# EAGLE design ESP32_BioReactor_v1 (EAGLE 9.6.1)
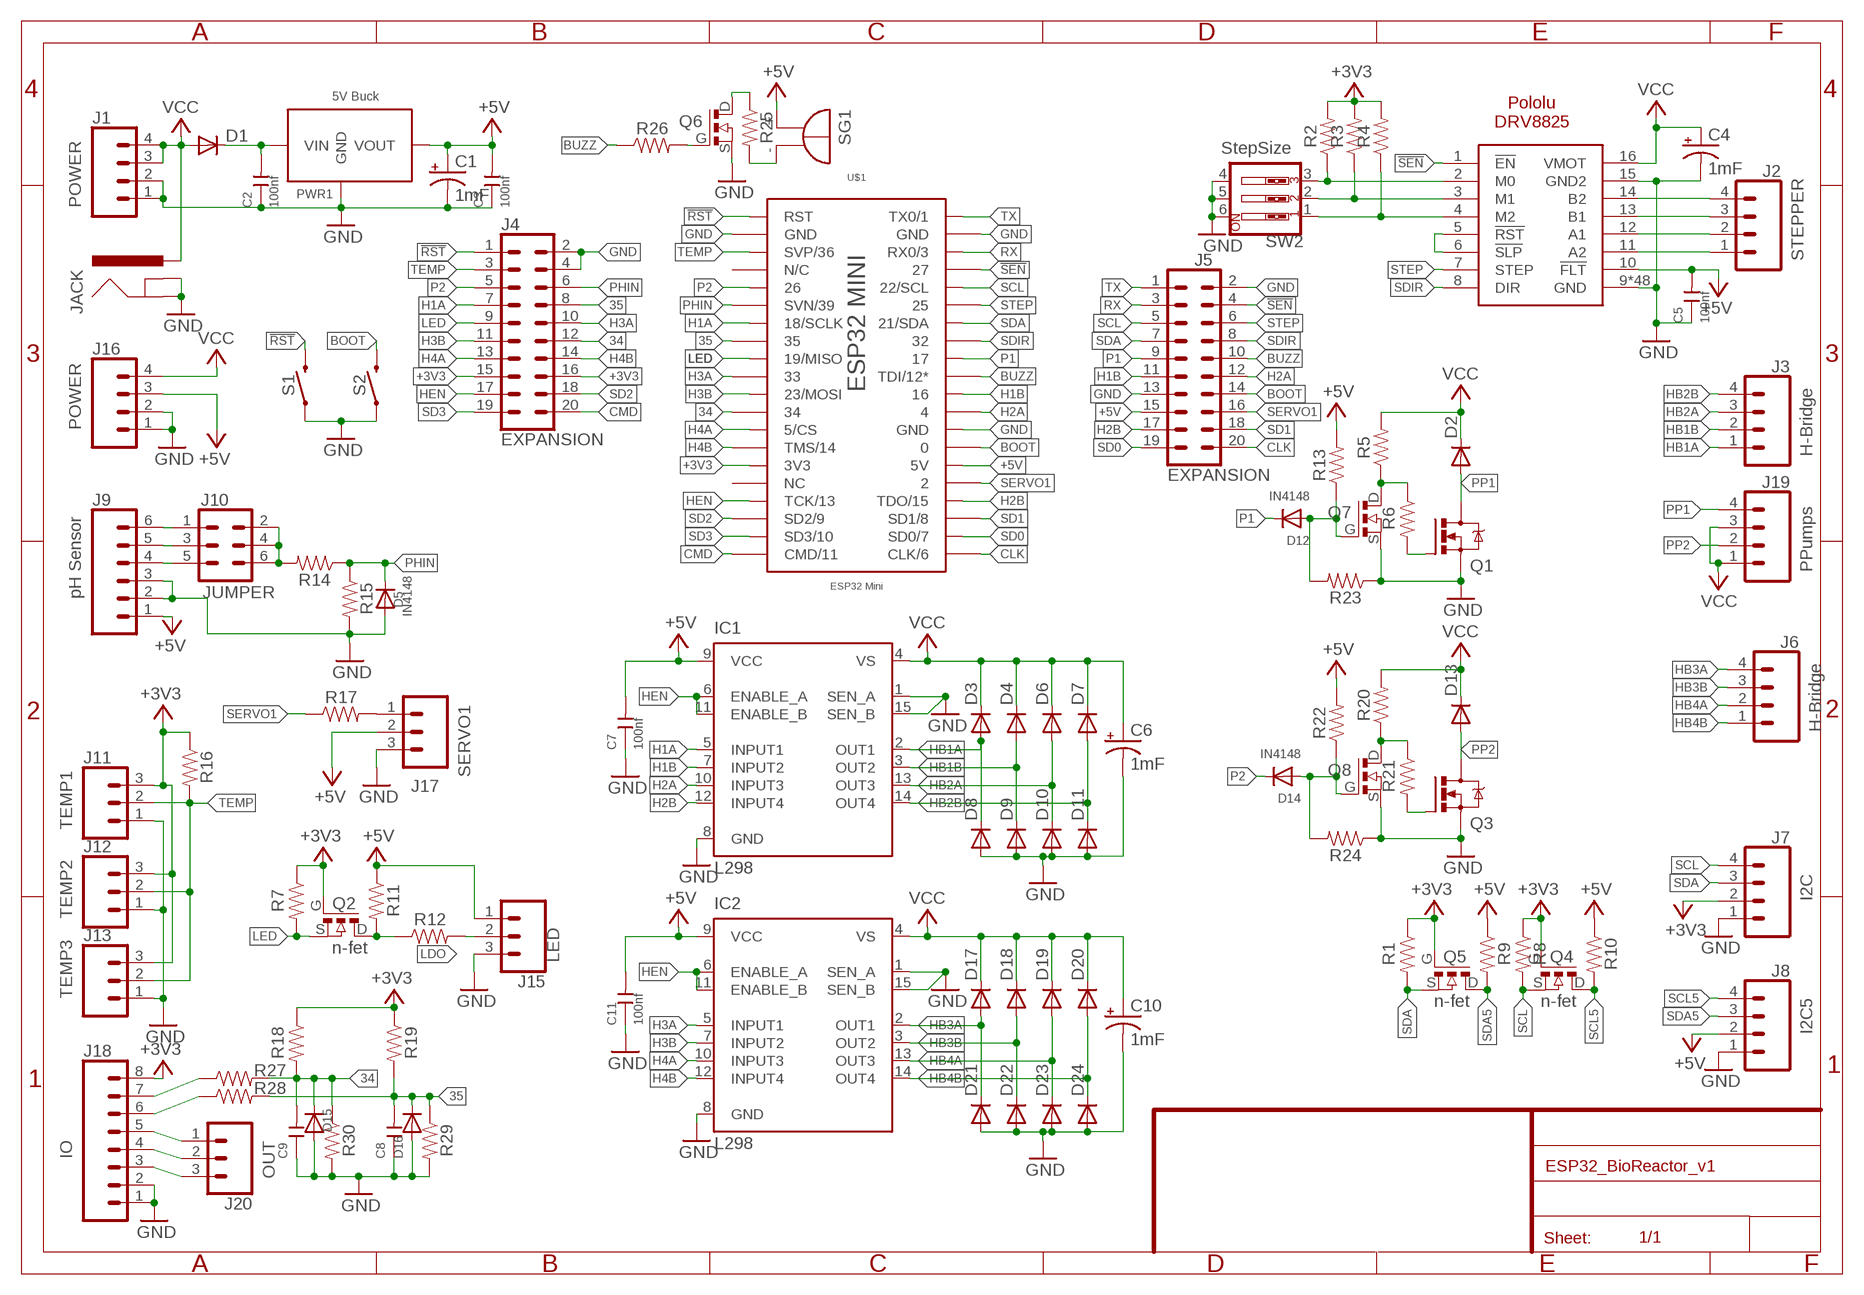
[diagram p0: schematic, sheet 1]

## Parts
C1  1mF  1000UF-RADIAL-5MM-25V-20%  [CPOL-RADIAL-5MM-10MM]
C2  100nf  DIP-CERAMIC-DISC-100NF-50V-Y5V(D5.0MM)  [CERAMIC-2.54]
C3  100nf  DIP-CERAMIC-DISC-100NF-50V-Y5V(D5.0MM)  [CERAMIC-2.54]
C4  1mF  1000UF-RADIAL-5MM-25V-20%  [CPOL-RADIAL-5MM-10MM]
C5  100nf  DIP-CERAMIC-DISC-100NF-50V-Y5V(D5.0MM)  [CERAMIC-2.54]
C6  1mF  1000UF-RADIAL-5MM-25V-20%  [CPOL-RADIAL-5MM-10MM]
C7  100nf  DIP-CERAMIC-DISC-100NF-50V-Y5V(D5.0MM)  [CERAMIC-2.54]
C8  100nf  DIP-CERAMIC-DISC-100NF-50V-Y5V(D5.0MM)  [CERAMIC-2.54]
C9  100nf  DIP-CERAMIC-DISC-100NF-50V-Y5V(D5.0MM)  [CERAMIC-2.54]
C10  1mF  1000UF-RADIAL-5MM-25V-20%  [CPOL-RADIAL-5MM-10MM]
C11  100nf  DIP-CERAMIC-DISC-100NF-50V-Y5V(D5.0MM)  [CERAMIC-2.54]
D1  1N4004  [DO41-10]
D2  1N4004  [DO41-10]
D3  1N4004  [DO41-10]
D4  1N4004  [DO41-10]
D5  IN4148  DIODEDO-1N4148  [DO-1N4148]
D6  1N4004  [DO41-10]
D7  1N4004  [DO41-10]
D8  1N4004  [DO41-10]
D9  1N4004  [DO41-10]
D10  1N4004  [DO41-10]
D11  1N4004  [DO41-10]
D12  IN4148  DIODEDO-1N4148  [DO-1N4148]
D13  1N4004  [DO41-10]
D14  IN4148  DIODEDO-1N4148  [DO-1N4148]
D15  IN4148  DIODEDO-1N4148  [DO-1N4148]
D16  IN4148  DIODEDO-1N4148  [DO-1N4148]
D17  1N4004  [DO41-10]
D18  1N4004  [DO41-10]
D19  1N4004  [DO41-10]
D20  1N4004  [DO41-10]
D21  1N4004  [DO41-10]
D22  1N4004  [DO41-10]
D23  1N4004  [DO41-10]
D24  1N4004  [DO41-10]
DR1  DRV8825  POLOLU-DRV8825  [POLOLU-DRV8825]
IC1  L298  [MULTIWATT-15]
IC2  L298  [MULTIWATT-15]
J1  POWER  CONN_04LONGPADS  [1X04_LONGPADS]
J2  STEPPER  CONN_04LONGPADS  [1X04_LONGPADS]
J3  H-Bridge  CONN_04LONGPADS  [1X04_LONGPADS]
J4  EXPANSION  CONN_10X2NOSILK  [2X10_NOSILK]
J5  EXPANSION  CONN_10X2NOSILK  [2X10_NOSILK]
J6  H-Bridge  CONN_04LONGPADS  [1X04_LONGPADS]
J7  I2C  CONN_04LONGPADS  [1X04_LONGPADS]
J8  I2C5  CONN_04LONGPADS  [1X04_LONGPADS]
J9  pH Sensor  CONN_06LONGPADS  [1X06_LONGPADS]
J10  JUMPER  CONN_03X2FEMALE  [2X3]
J11  TEMP1  CONN_03LONGPADS  [1X03_LONGPADS]
J12  TEMP2  CONN_03LONGPADS  [1X03_LONGPADS]
J13  TEMP3  CONN_03LONGPADS  [1X03_LONGPADS]
J15  LED  CONN_03LONGPADS  [1X03_LONGPADS]
J16  POWER  CONN_04LONGPADS  [1X04_LONGPADS]
J17  SERVO1  CONN_03LONGPADS  [1X03_LONGPADS]
J18  IO  CONN_08LONGPADS  [1X08_LONGPADS]
J19  PPumps  CONN_04LONGPADS  [1X04_LONGPADS]
J20  OUT  CONN_03  [1X03]
JACK  POWER_JACKPTH_LOCK  [POWER_JACK_PTH_LOCK]
PWR1  5V Buck  5VBUCK  [5VBUCK]
Q1  IRF740  [TO220BV]
Q2  n-fet  2N7000  [TO92260P520H533-3]
Q3  IRF740  [TO220BV]
Q4  n-fet  2N7000  [TO92260P520H533-3]
Q5  n-fet  2N7000  [TO92260P520H533-3]
Q6  2N7000  [TO92260P520H533-3]
Q7  2N7000  [TO92260P520H533-3]
Q8  2N7000  [TO92260P520H533-3]
R1  10k  10KOHM-HORIZ-1/4W-1%  [AXIAL-0.3]
R2  10k  10KOHM-HORIZ-1/4W-1%  [AXIAL-0.3]
R3  10k  10KOHM-HORIZ-1/4W-1%  [AXIAL-0.3]
R4  10k  10KOHM-HORIZ-1/4W-1%  [AXIAL-0.3]
R5  10k  10KOHM-HORIZ-1/4W-1%  [AXIAL-0.3]
R6  10k  10KOHM-HORIZ-1/4W-1%  [AXIAL-0.3]
R7  10k  10KOHM-HORIZ-1/4W-1%  [AXIAL-0.3]
R8  10k  10KOHM-HORIZ-1/4W-1%  [AXIAL-0.3]
R9  10k  10KOHM-HORIZ-1/4W-1%  [AXIAL-0.3]
R10  10k  10KOHM-HORIZ-1/4W-1%  [AXIAL-0.3]
R11  10k  10KOHM-HORIZ-1/4W-1%  [AXIAL-0.3]
R12  10k  10KOHM-HORIZ-1/4W-1%  [AXIAL-0.3]
R13  10k  10KOHM-HORIZ-1/4W-1%  [AXIAL-0.3]
R14  10k  10KOHM-HORIZ-1/4W-1%  [AXIAL-0.3]
R15  10k  10KOHM-HORIZ-1/4W-1%  [AXIAL-0.3]
R16  10k  10KOHM-HORIZ-1/4W-1%  [AXIAL-0.3]
R17  10k  10KOHM-HORIZ-1/4W-1%  [AXIAL-0.3]
R18  10k  10KOHM-HORIZ-1/4W-1%  [AXIAL-0.3]
R19  10k  10KOHM-HORIZ-1/4W-1%  [AXIAL-0.3]
R20  10k  10KOHM-HORIZ-1/4W-1%  [AXIAL-0.3]
R21  10k  10KOHM-HORIZ-1/4W-1%  [AXIAL-0.3]
R22  10k  10KOHM-HORIZ-1/4W-1%  [AXIAL-0.3]
R23  10k  10KOHM-HORIZ-1/4W-1%  [AXIAL-0.3]
R24  10k  10KOHM-HORIZ-1/4W-1%  [AXIAL-0.3]
R25  10k  10KOHM-HORIZ-1/4W-1%  [AXIAL-0.3]
R26  10k  10KOHM-HORIZ-1/4W-1%  [AXIAL-0.3]
R27  10k  10KOHM-HORIZ-1/4W-1%  [AXIAL-0.3]
R28  10k  10KOHM-HORIZ-1/4W-1%  [AXIAL-0.3]
R29  10k  10KOHM-HORIZ-1/4W-1%  [AXIAL-0.3]
R30  10k  10KOHM-HORIZ-1/4W-1%  [AXIAL-0.3]
S1  MOMENTARY-SWITCH-SPST-PTH-6.0MM  [TACTILE_SWITCH_PTH_6.0MM]
S2  MOMENTARY-SWITCH-SPST-PTH-6.0MM  [TACTILE_SWITCH_PTH_6.0MM]
SG1  F/HMB  [F/HMB]
SW2  StepSize  SW_DIP-3  [EDG-03]
U$1  ESP32 Mini  ESP32MINI  [ESP32MINI]

## Nets
34: C9.2 D15.C J4.12 R18.P$2 R27.P$2 R30.P$1 U$1.34
35: C8.2 D16.C J4.8 R19.P$2 R28.P$2 R29.P$1 U$1.35
!RST: J4.1 S1.3 U$1.RST
!SEN: DR1.1(!EN) J5.4 U$1.27
+3V3: J4.15 J4.16 J7.2 J11.3 J12.3 J13.3 J18.8 Q2.G Q4.G Q5.G R1.P$1 R2.P$2 R3.P$2 R4.P$2 R7.P$1 R8.P$1 R16.P$1 R18.P$1 R19.P$1 U$1.3V3
+5V [5V]: C1.+ C3.2 C5.2 C7.2 C11.2 DR1.10(!FLT) IC1.9(VCC) IC2.9(VCC) J5.15 J8.2 J9.1 J15.1 J16.3 J17.2 PWR1.VOUT R9.P$1 R10.P$1 R11.P$1 R13.P$2 R22.P$2 SG1.+ U$1.5V
BOOT: J5.14 S2.3 U$1.0
BUZZ: J5.10 R26.P$1 U$1.TDI(TDI/12*)
CLK: J5.20 U$1.CLK(CLK/6)
CMD: J4.20 U$1.CMD(CMD/11)
GND [GND]: C1.- C2.1 C3.1 C4.- C5.1 C6.- C7.1 C8.1 C9.1 C10.- C11.1 D5.A D8.A D9.A D10.A D11.A D15.A D16.A D21.A D22.A D23.A D24.A DR1.9(GND) DR1.15(GND2) DR1.GND@1(GND) DR1.GND@2(GND) DR1.GND@3(GND) DR1.GND@4(GND) DR1.GND@5(GND) DR1.GND@6(GND) DR1.GND@7(GND) DR1.GND@8(GND) DR1.GND@9(GND) DR1.GND@10(GND) DR1.GND@11(GND) DR1.GND@12(GND) DR1.GND@13(GND) DR1.GND@14(GND) DR1.GND@15(GND) DR1.GND@16(GND) DR1.GND@17(GND) DR1.GND@18(GND) DR1.GND@19(GND) DR1.GND@20(GND) DR1.GND@21(GND) DR1.GND@22(GND) DR1.GND@23(GND) DR1.GND@24(GND) DR1.GND@25(GND) DR1.GND@26(GND) DR1.GND@27(GND) DR1.GND@28(GND) DR1.GND@29(GND) DR1.GND@30(GND) DR1.GND@31(GND) DR1.GND@32(GND) DR1.GND@33(GND) DR1.GND@34(GND) DR1.GND@35(GND) DR1.GND@36(GND) DR1.GND@37(GND) DR1.GND@38(GND) DR1.GND@39(GND) DR1.GND@40(GND) DR1.GND@41(GND) DR1.GND@42(GND) DR1.GND@43(GND) DR1.GND@44(GND) DR1.GND@45(GND) DR1.GND@50(GND) DR1.GND@51(GND) IC1.1(SEN_A) IC1.8(GND) IC1.15(SEN_B) IC2.1(SEN_A) IC2.8(GND) IC2.15(SEN_B) J1.1 J1.2 J4.2 J4.4 J5.2 J5.13 J7.1 J8.1 J9.2 J9.3 J11.1 J12.1 J13.1 J15.3 J16.1 J16.2 J17.3 J18.1 J18.2 JACK.GND JACK.GNDBREAK PWR1.GND Q1.S Q3.S Q6.S Q7.S Q8.S R15.P$2 R23.P$1 R24.P$1 R29.P$2 R30.P$2 S1.1 S2.1 SW2.4 SW2.5 SW2.6 U$1.GND@1(GND) U$1.GND@2(GND) U$1.GND@3(GND)
H1A: IC1.5(INPUT1) J4.7 U$1.18(18/SCLK)
H1B: IC1.7(INPUT2) J5.11 U$1.16
H2A: IC1.10(INPUT3) J5.12 U$1.4
H2B: IC1.12(INPUT4) J5.17 U$1.TDO(TDO/15)
H3A: IC2.5(INPUT1) J4.10 U$1.33
H3B: IC2.7(INPUT2) J4.11 U$1.23(23/MOSI)
H4A: IC2.10(INPUT3) J4.13 U$1.5(5/CS)
H4B: IC2.12(INPUT4) J4.14 U$1.TMS(TMS/14)
HB1A [POWER]: D3.A D8.C IC1.2(OUT1) J3.1
HB1B [POWER]: D4.A D9.C IC1.3(OUT2) J3.2
HB2A [POWER]: D6.A D10.C IC1.13(OUT3) J3.3
HB2B [POWER]: D7.A D11.C IC1.14(OUT4) J3.4
HB3A [POWER]: D17.A D21.C IC2.2(OUT1) J6.4
HB3B [POWER]: D18.A D22.C IC2.3(OUT2) J6.3
HB4A [POWER]: D19.A D23.C IC2.13(OUT3) J6.2
HB4B [POWER]: D20.A D24.C IC2.14(OUT4) J6.1
HEN: IC1.6(ENABLE_A) IC1.11(ENABLE_B) IC2.6(ENABLE_A) IC2.11(ENABLE_B) J4.17 U$1.TCK(TCK/13)
LDO: J15.2 R12.P$2
LED: J4.9 Q2.S R7.P$2 U$1.19(19/MISO)
N$1: DR1.3(M1) R3.P$1 SW2.2
N$2 [5V]: C2.2 D1.C PWR1.VIN
N$3: DR1.4(M2) R4.P$1 SW2.1
N$4: Q7.D R5.P$1 R6.P$1
N$5: DR1.5(!RST) DR1.6(!SLP)
N$6: J10.2 J10.4 J10.6 R14.P$2
N$7: Q1.G R6.P$2
N$8: DR1.2(M0) R2.P$1 SW2.3
N$9: Q8.D R20.P$1 R21.P$1
N$10: R25.P$2 SG1.-
N$11: Q3.G R21.P$2
N$12 [POWER]: DR1.11(A2) J2.1
N$13 [POWER]: DR1.12(A1) J2.2
N$14 [POWER]: DR1.13(B1) J2.3
N$15 [POWER]: DR1.14(B2) J2.4
N$16: D14.A Q8.G R22.P$1 R24.P$2
N$17: J9.4 J10.5
N$18: Q6.D R25.P$1
N$19: Q6.G R26.P$2
N$20: J9.5 J10.3
N$21: J9.6 J10.1
N$22: D12.A Q7.G R13.P$1 R23.P$2
N$23: Q2.D R11.P$2 R12.P$1
N$24: J17.1 R17.P$2
N$25: J18.5 J20.1
N$26: J18.4 J20.2
N$27: J18.3 J20.3
N$29: J18.6 R28.P$1
N$30: J18.7 R27.P$1
P1: D12.C J5.9 U$1.17
P2: D14.C J4.5 U$1.26
PHIN: D5.C J4.6 R14.P$1 R15.P$1 U$1.SVN(SVN/39)
PP1 [POWER]: D2.A J19.4 Q1.D
PP2: D13.A J19.2 Q3.D
RX: J5.3 U$1.RX0(RX0/3)
SCL: J5.5 J7.4 Q4.S R8.P$2 U$1.22(22/SCL)
SCL5: J8.4 Q4.D R10.P$2
SD0: J5.19 U$1.SD0(SD0/7)
SD1: J5.18 U$1.SD1(SD1/8)
SD2: J4.18 U$1.SD2(SD2/9)
SD3: J4.19 U$1.SD3(SD3/10)
SDA: J5.7 J7.3 Q5.S R1.P$2 U$1.21(21/SDA)
SDA5: J8.3 Q5.D R9.P$2
SDIR: DR1.8(DIR) J5.8 U$1.32
SERVO1: J5.16 R17.P$1 U$1.2
STEP: DR1.7(STEP) J5.6 U$1.25
TEMP: J4.3 J11.2 J12.2 J13.2 R16.P$2 U$1.SVP(SVP/36)
TX: J5.1 U$1.TX0(TX0/1)
VCC [POWER]: C4.+ C6.+ C10.+ D1.A D2.C D3.C D4.C D6.C D7.C D13.C D17.C D18.C D19.C D20.C DR1.16(VMOT) IC1.4(VS) IC2.4(VS) J1.3 J1.4 J16.4 J19.1 J19.3 JACK.PWR R5.P$2 R20.P$2
Unconnected: U$1.NC(N/C) U$1.NC.1(NC)

## Library data of the parts
C1 C4 C6 C10 = 1_Adrian:1000UF: 1,000µF/1mF ceramic capacitors A capacitor is a passive two-terminal electrical component used to store electrical energy temporarily in an electric field. CAP-08070; PROD_ID: CAP-09538
C2 C3 C5 C7-C9 C11 = 1_Adrian:DIP-CERAMIC-DISC-100NF-50V-Y5V(D5.0MM): 302010208; MPN: CC1-F5SL2A101KSPW
D1-D4 D6-D11 D13 D17-D24 = 1_Adrian:1N4004: DIODE General purpose 1N400x type rectifier (With bigger pads) http://www.ladyada.net/library/pcb/eaglelibrary.html
D5 D12 D14-D16 = adafruit:DIODE: Diode SMADIODE - SMA Surface Mount Package 20V 1A Schottky Diode Digikey: 641-1014-6-ND DO-1N4148 - Through Hole Small Current Diode SOD-123 20V 1 A (.5mV Vf) Schottky Diode - Digikey: MBRX120TPMSCT-ND SOD-323 10V 570mA (.38mV Vf, 3ns) Schottky Diode - Digikey: ZLLS410CT-ND SOD-523 30V 30mA Schottky Diode (RB751S-40TE61) - Digikey: RB751S-40TE61CT-ND SOT23-R/W - SOT23 Package (R = Solder Paste/Reflow Ovens, W = Hand-Soldering) BAT54Film 40V 300mA - Digikey: 497-7162-1-ND
DR1 = 1_Adrian:POLOLU-DRV8825
IC1 IC2 = st-microelectronics:L298: DUAL FULL-BRIDGE DRIVER; MPN: L298N; OC_FARNELL: 1589425; OC_NEWARK: 32M1527
J1-J3 J6-J8 J16 J19 = 1_Adrian:CONN_04: Multi connection point. Often used as Generic Header-pin footprint for 0.1 inch spaced/style header connections On any of the 0.1 inch spaced packages, you can populate with these: Break Away Headers - Straight <https://www.sparkfun.com/products/116> (PRT-00116) Break Away Male Headers - Right Angle <https://www.sparkfun.com/products/553> (PRT-00553) Female Headers <https://www.sparkfun.com/products/115> (PRT-00115) Break Away Headers - Machine Pin <https://www.sparkfun.com/products/117> (PRT-00117) Break Away Female Headers - Swiss Machine Pin <https://www.sparkfun.com/products/743> (PRT-00743) For SCREWTERMINALS and SPRING TERMINALS visit here: Screw Terimnals on SparkFun.com <https://www.sparkfun.com/search/results?term=Screw+Terminals> (5mm/3.5mm/2.54mm spacing) This device is also useful as a general connection point to wire up your design to another part of your project. Our various solder wires solder well into these plated through hole pads. Hook-Up Wire - Assortment (Stranded, 22 AWG) <https://www.sparkfun.com/products/11375> (PRT-11375) Hook-Up Wire - Assortment (Solid Core, 22 AWG) <https://www.sparkfun.com/products/11367> (PRT-11367) View the entire wire category on our website here <https://www.sparkfun.com/categories/141> Special notes: Molex polarized connector foot print use with SKU : PRT-08231 with associated crimp pins and housings. 1MM SMD Version SKU: PRT-10208; PROD_ID: CONN-09696
J4 J5 = SparkFun-Connectors:CONN_10X2: Multi connection point. Often used as Generic Header-pin footprint for 0.1 inch spaced/style header connections On any of the 0.1 inch spaced packages, you can populate with these: Break Away Headers - Straight <https://www.sparkfun.com/products/116> (PRT-00116) Break Away Male Headers - Right Angle <https://www.sparkfun.com/products/553> (PRT-00553) Female Headers <https://www.sparkfun.com/products/115> (PRT-00115) Break Away Headers - Machine Pin <https://www.sparkfun.com/products/117> (PRT-00117) Break Away Female Headers - Swiss Machine Pin <https://www.sparkfun.com/products/743> (PRT-00743) Special note about the "SPECIAL" package: This was SPECIALLY designed to be used with our Graphic LCD Backpack. Be sure you want to use this! It is not only staggered on each line of header holes, but IT IS ALSO offset of the center point of the top and bottom lines by 5 mil. This causes the headers to lock into place on the "standard" footprint on the LCD screen. The extra squares on the tdocu layer are there simply to reference other pins (if you were to actually populate a longer header than ten long - this is what we do with the backpacks).
J9 = SparkFun-Connectors:CONN_06: Multi connection point. Often used as Generic Header-pin footprint for 0.1 inch spaced/style header connections On any of the 0.1 inch spaced packages, you can populate with these: Break Away Headers - Straight <https://www.sparkfun.com/products/116> (PRT-00116) Break Away Male Headers - Right Angle <https://www.sparkfun.com/products/553> (PRT-00553) Female Headers <https://www.sparkfun.com/products/115> (PRT-00115) Break Away Headers - Machine Pin <https://www.sparkfun.com/products/117> (PRT-00117) Break Away Female Headers - Swiss Machine Pin <https://www.sparkfun.com/products/743> (PRT-00743) Arduino Stackable Header - 6 Pin <https://www.sparkfun.com/products/9280> (PRT-09280) For SCREWTERMINALS and SPRING TERMINALS visit here: Screw Terimnals on SparkFun.com <https://www.sparkfun.com/search/results?term=Screw+Terminals> (5mm/3.5mm/2.54mm spacing) This device is also useful as a general connection point to wire up your design to another part of your project. Our various solder wires solder well into these plated through hole pads. Hook-Up Wire - Assortment (Stranded, 22 AWG) <https://www.sparkfun.com/products/11375> (PRT-11375) Hook-Up Wire - Assortment (Solid Core, 22 AWG) <https://www.sparkfun.com/products/11367> (PRT-11367) View the entire wire category on our website here <https://www.sparkfun.com/categories/141>
J10 = SparkFun-Connectors:CONN_03X2: Multi connection point. Often used as Generic Header-pin footprint for 0.1 inch spaced/style header connections You can populate with any combo of single row headers, but if you'd like an exact match, check these: Header - 2x3 (Male, 0.1") <https://www.sparkfun.com/products/12807> (PRT-12807) Header - 2x3 (Female, 0.1") <https://www.sparkfun.com/products/13010> (PRT-13010) 2x3 Pin Shrouded Header <https://www.sparkfun.com/products/10877> (PRT-10877) On any of the 0.1 inch spaced packages, you can populate with these: Break Away Headers - Straight <https://www.sparkfun.com/products/116> (PRT-00116) Break Away Male Headers - Right Angle <https://www.sparkfun.com/products/553> (PRT-00553) Female Headers <https://www.sparkfun.com/products/115> (PRT-00115) Break Away Headers - Machine Pin <https://www.sparkfun.com/products/117> (PRT-00117) Break Away Female Headers - Swiss Machine Pin <https://www.sparkfun.com/products/743> (PRT-00743) Special note: the shrouded connector mates well with our 3x2 ribbon cables: Ribbon Crimp Connector - 6-pin (2x3, Female) <https://www.sparkfun.com/products/10651> (PRT-10651) Ribbon Cable - 6 wire (15ft) <https://www.sparkfun.com/products/10646> (PRT-10646); PROD_ID: CONN-11566; VALUE: FEMALE 2x3
J11-J13 J15 J17 J20 = 1_Adrian:CONN_03: Multi connection point. Often used as Generic Header-pin footprint for 0.1 inch spaced/style header connections On any of the 0.1 inch spaced packages, you can populate with these: Break Away Headers - Straight <https://www.sparkfun.com/products/116> (PRT-00116) Break Away Male Headers - Right Angle <https://www.sparkfun.com/products/553> (PRT-00553) Female Headers <https://www.sparkfun.com/products/115> (PRT-00115) Break Away Headers - Machine Pin <https://www.sparkfun.com/products/117> (PRT-00117) Break Away Female Headers - Swiss Machine Pin <https://www.sparkfun.com/products/743> (PRT-00743) Stackable Header - 3 Pin (Female, 0.1") <https://www.sparkfun.com/products/13875> (PRT-13875) For SCREWTERMINALS and SPRING TERMINALS visit here: Screw Terimnals on SparkFun.com <https://www.sparkfun.com/search/results?term=Screw+Terminals> (5mm/3.5mm/2.54mm spacing) This device is also useful as a general connection point to wire up your design to another part of your project. Our various solder wires solder well into these plated through hole pads. Hook-Up Wire - Assortment (Stranded, 22 AWG) <https://www.sparkfun.com/products/11375> (PRT-11375) Hook-Up Wire - Assortment (Solid Core, 22 AWG) <https://www.sparkfun.com/products/11367> (PRT-11367) View the entire wire category on our website here <https://www.sparkfun.com/categories/141> Special notes: Molex polarized connector foot print use with SKU : PRT-08232 with associated crimp pins and housings.
J18 = SparkFun-Connectors:CONN_08: Multi connection point. Often used as Generic Header-pin footprint for 0.1 inch spaced/style header connections On any of the 0.1 inch spaced packages, you can populate with these: Break Away Headers - Straight <https://www.sparkfun.com/products/116> (PRT-00116) Break Away Male Headers - Right Angle <https://www.sparkfun.com/products/553> (PRT-00553) Female Headers <https://www.sparkfun.com/products/115> (PRT-00115) Break Away Headers - Machine Pin <https://www.sparkfun.com/products/117> (PRT-00117) Break Away Female Headers - Swiss Machine Pin <https://www.sparkfun.com/products/743> (PRT-00743) Arduino Stackable Header - 8 Pin <https://www.sparkfun.com/products/9279> (PRT-09279) For SCREWTERMINALS and SPRING TERMINALS visit here: Screw Terimnals on SparkFun.com <https://www.sparkfun.com/search/results?term=Screw+Terminals> (5mm/3.5mm/2.54mm spacing) This device is also useful as a general connection point to wire up your design to another part of your project. Our various solder wires solder well into these plated through hole pads. Hook-Up Wire - Assortment (Stranded, 22 AWG) <https://www.sparkfun.com/products/11375> (PRT-11375) Hook-Up Wire - Assortment (Solid Core, 22 AWG) <https://www.sparkfun.com/products/11367> (PRT-11367) View the entire wire category on our website here <https://www.sparkfun.com/categories/141> Special notes: Molex polarized connector foot print use with SKU : PRT-08231 with associated crimp pins and housings. 1MM SMD Version SKU: PRT-10208 NOTES ON THE VARIANTS LOCK and LOCK_LONGPADS... This footprint was designed to help hold the alignment of a through-hole component (i.e. 6-pin header) while soldering it into place. You may notice that each hole has been shifted either up or down by 0.005 of an inch from it's more standard position (which is a perfectly straight line). This slight alteration caused the pins (the squares in the middle) to touch the edges of the holes. Because they are alternating, it causes a "brace" to hold the component in place. 0.005 has proven to be the perfect amount of "off-center" position when using our standard breakaway headers. Although looks a little odd when you look at the bare footprint, once you have a header in there, the alteration is very hard to notice. Also,if you push a header all the way into place, it is covered up entirely on the bottom side.
JACK = SparkFun-Connectors:POWER_JACK: Power Jack Connector This is the standard 5.5mm barrel jack for power. The PTH is the most common, proven, reliable, footprint. The Slot footprint only works if the mill layer is transmitted to the PCB fab house so be warned. Here are the connectors we sell at SparkFun: DC Barrel Power Jack/Connector <https://www.sparkfun.com/products/119> (PRT-00119) DC Barrel Power Jack/Connector (SMD) <https://www.sparkfun.com/products/12748> (PRT-12748) DC Barrel Jack Adapter - Breadboard Compatible <https://www.sparkfun.com/products/10811> (PRT-10811) It is used on this SparkFun product (and many, many others): SparkFun RedBoard - Programmed with Arduino <https://www.sparkfun.com/products/12757> (DEV-12757) Also, if you need a mating power supply or connector, please check these out: Wall Adapter Power Supply - 9VDC 650mA <https://www.sparkfun.com/products/298> (TOL-00298) DC Barrel Jack Adapter - Male <https://www.sparkfun.com/products/10287> (PRT-10287); PROD_ID: CONN-08197; SF_ID: PRT-00119
PWR1 = 1_Adrian:5VBUCK: 5V Buck Converter (2A)
Q1 Q3 = transistor-power:IRF740: N-CHANNEL MOS FET
Q2 Q4-Q8 = 1_Adrian:2N7000; AVAILABILITY: Unavailable; DESCRIPTION: MOSFETs- Power and Small Signal 60V 200mA N-Channel No-Cancel/No-Return; MF: STMicroelectronics; MP: 2N7000; PACKAGE: TO-92 ON Semiconductor; PRICE: None
R1-R30 = 1_Adrian:10KOHM: 10kΩ resistor A resistor is a passive two-terminal electrical component that implements electrical resistance as a circuit element. Resistors act to reduce current flow, and, at the same time, act to lower voltage levels within circuits. - Wikipedia; PROD_ID: RES-12183
S1 S2 = SparkFun-Switches:MOMENTARY-SWITCH-SPST: Momentary Switch (Pushbutton) - SPST Normally-open (NO) SPST momentary switches (buttons, pushbuttons). Variants PTH-12MM - 12mm square, through-hole Momentary Pushbutton Switch - 12mm Square <https://www.sparkfun.com/products/9190> (COM-09190) PTH-6.0MM, PTH-6.0MM-KIT - 6.0mm square, through-hole Mini Pushbutton Switch <https://www.sparkfun.com/products/97> (COM-00097) KIT package intended for soldering kit's - only one side of pads' copper is exposed. PTH-RIGHT-ANGLE-KIT - Right-angle, through-hole Right Angle Tactile Button <https://www.sparkfun.com/products/10791> - Used on SparkFun BigTime Watch Kit <https://www.sparkfun.com/products/11734> SMD-12MM - 12mm square, surface-mount Tactile Button - SMD (12mm) <https://www.sparkfun.com/products/12993> (COM-12993) Used on SparkFun PicoBoard <https://www.sparkfun.com/products/11888> SMD-4.5MM - 4.5mm Square Trackball Switch Used on SparkFun Blackberry Trackballer Breakout <https://www.sparkfun.com/products/13169> SMD-4.6MMX2.8MM - 4.60mm x 2.80mm, surface mount Used on SparkFun SAMD21 Mini Breakout <https://www.sparkfun.com/products/13664> SMD-5.2MM, SMD-5.2-REDUNDANT - 5.2mm square, surface-mount Mini Pushbutton Switch - SMD <https://www.sparkfun.com/products/8720> (COM-08720) Used on Arduino Pro Mini <https://www.sparkfun.com/products/11114> REDUNDANT package connects both switch circuits together SMD-6.0X3.5MM - 6.0 x 3.5mm, surface mount Momentary Reset Switch SMD <https://www.sparkfun.com/products/8229> (COM-08229) SMD-6.2MM-TALL - 6.2mm square, surface mount Tactile Button - SMD (6mm) <https://www.sparkfun.com/products/12992> Used on SparkFun Digital Sandbox <https://www.sparkfun.com/products/12651> SMD-RIGHT-ANGLE - Right-angle, surface mount Used on SparkFun Block for Intel® Edison - Arduino <https://www.sparkfun.com/products/13036>; PROD_ID: SWCH-08441; SF_SKU: COM-00097
SG1 = buzzer:F/HMB: BUZZER Source: Buerklin; OC_FARNELL: unknown; OC_NEWARK: unknown
SW2 = 1_Adrian:SW_DIP-3: DIP SWITCH
U$1 = 1_Adrian:ESP32MINI

## Net classes
0 default: width 0.203 mm
1 5V: width 0.381 mm
3 GND: width 0.203 mm
4 POWER: width 1.016 mm

## Board
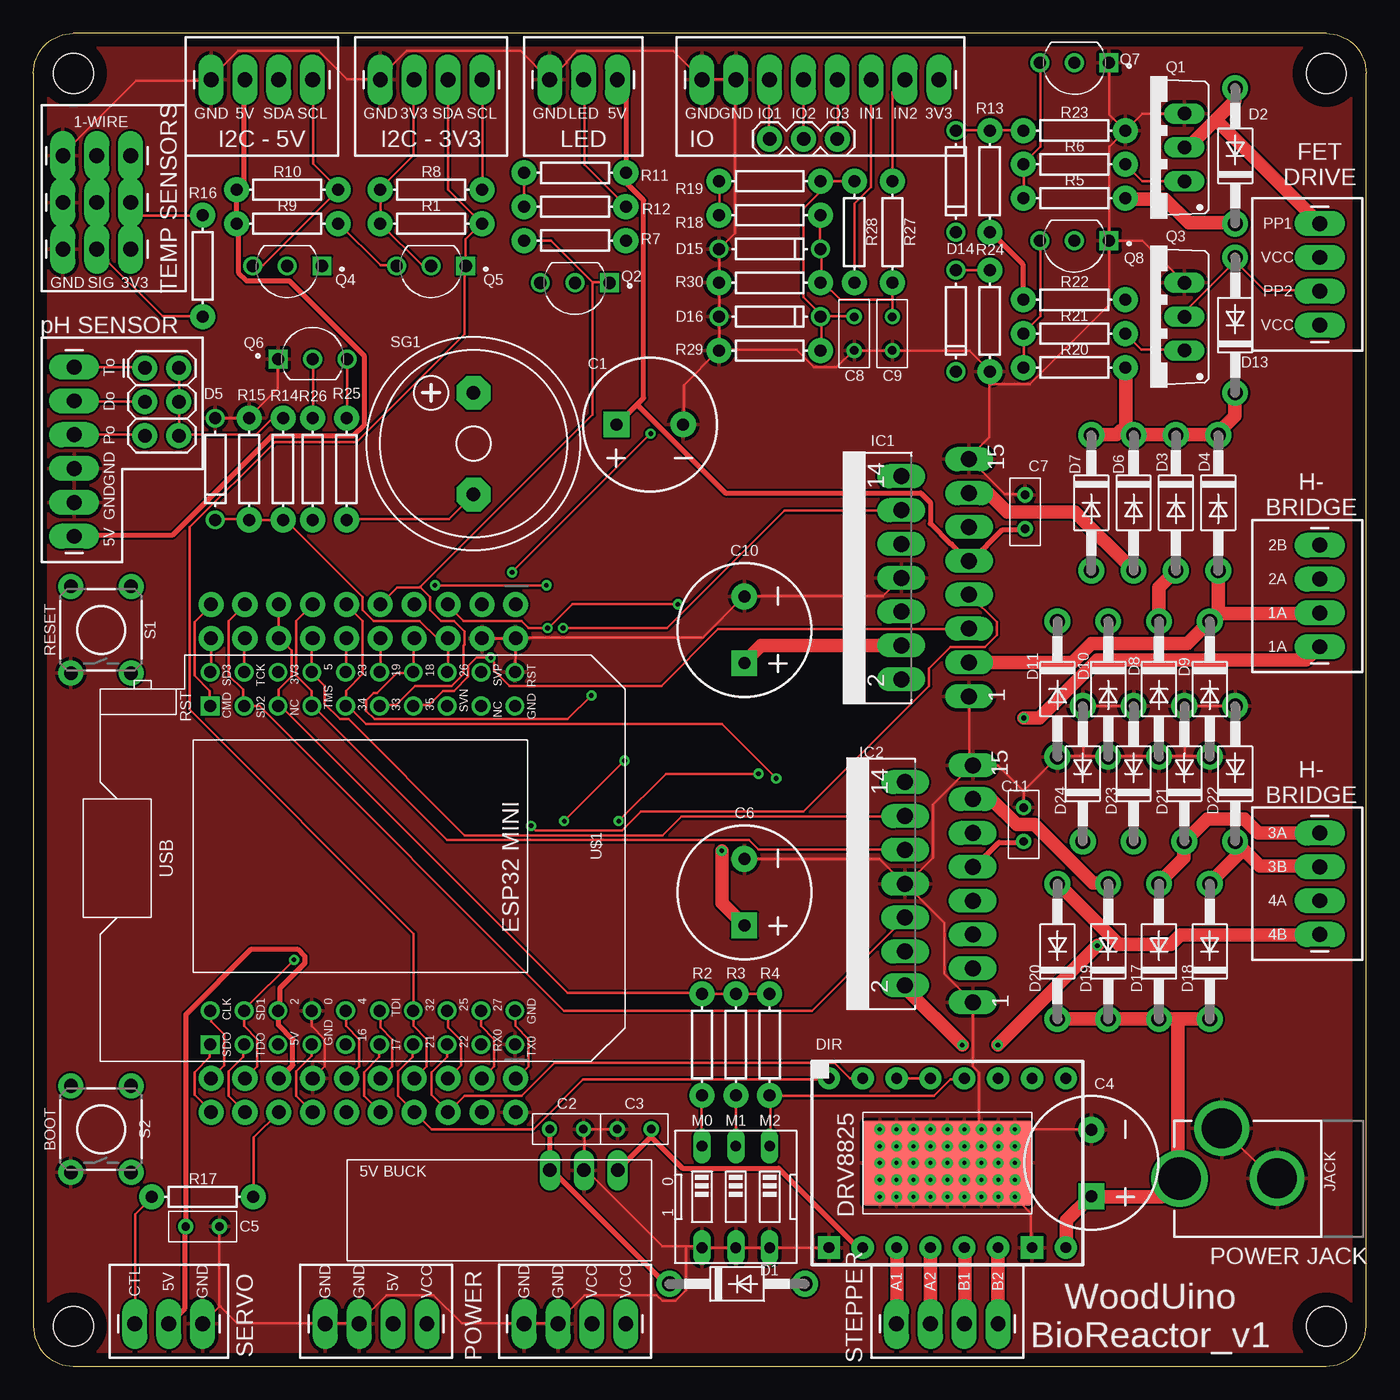
[diagram p1: board, top side]
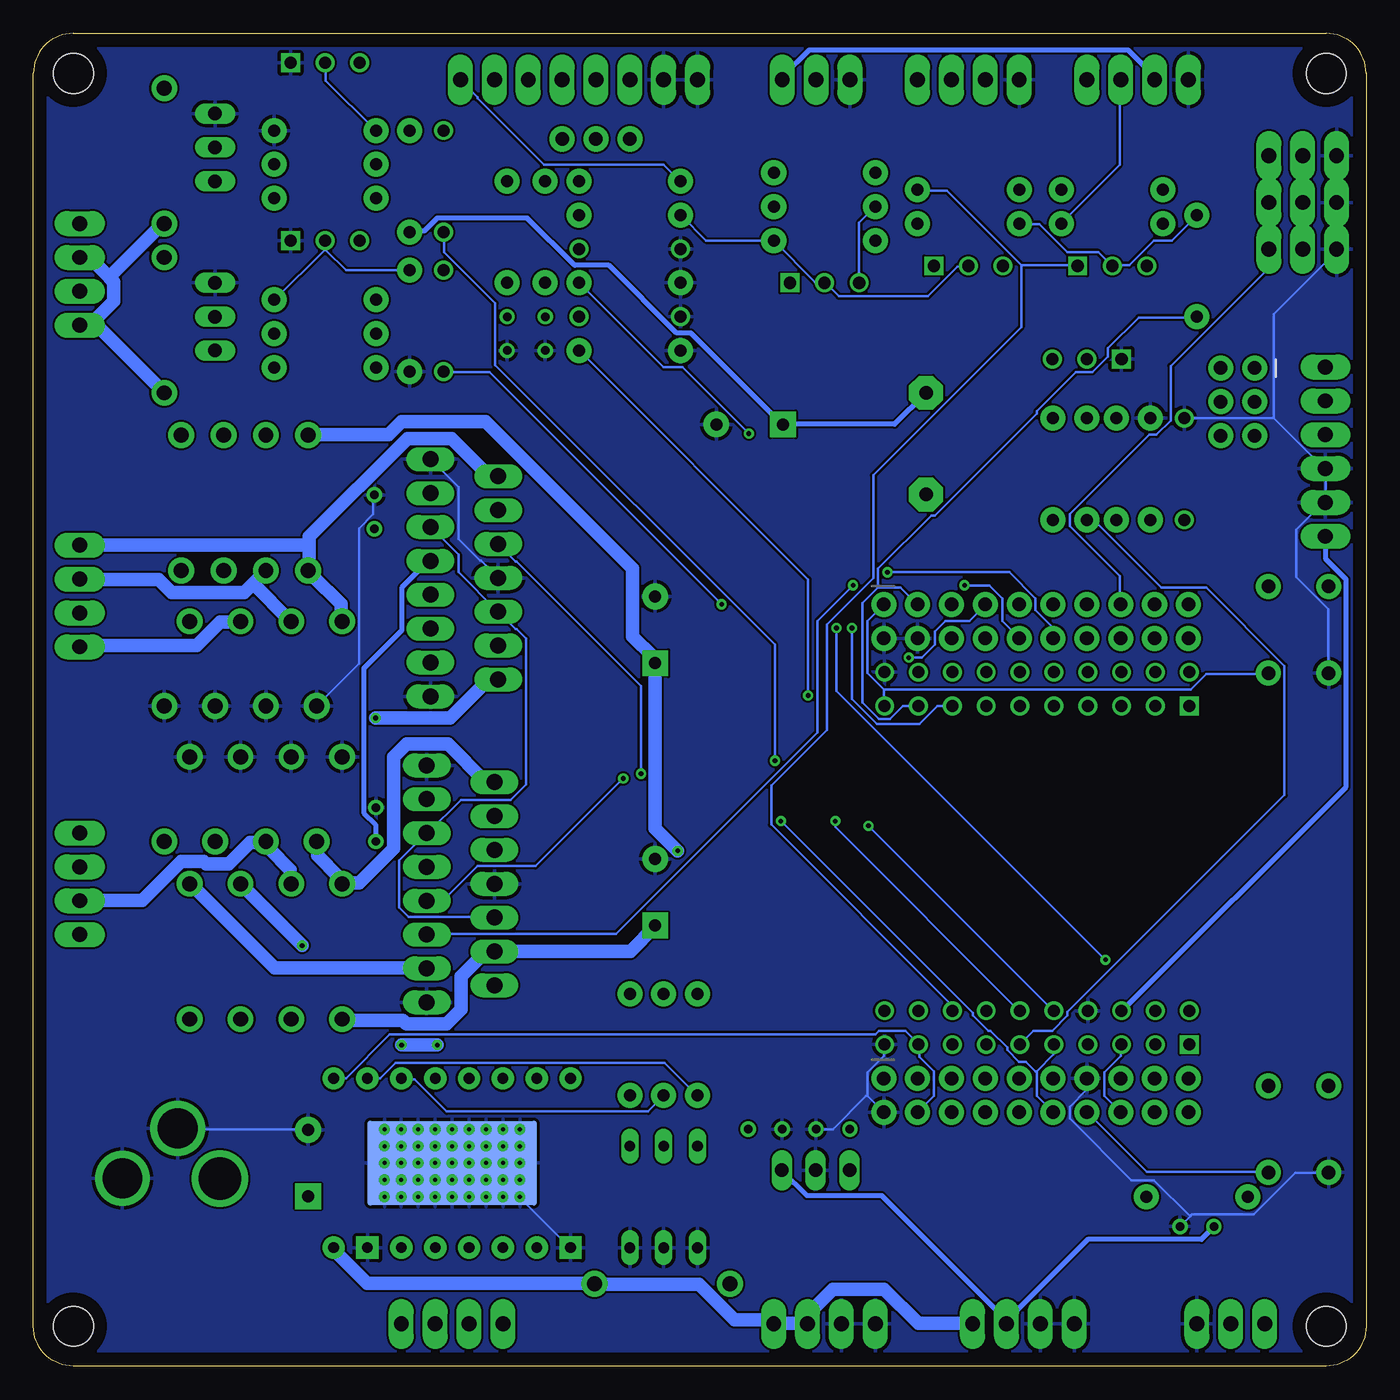
[diagram p2: board, bottom side, seen from below]

Size 100 x 100 mm. Coordinates in mm from the lower left corner, seen from the top.
Outline: 3,0 96,0 97,0 arc90 100,3 100,4 100,97 arc90 97,100 3,100 arc90 0,97 0,3 arc90 3,0
Copper layers (1*16): Top 0.035mm / dielectric 1.5mm / Bottom 0.035mm
Design rules "default": minimum track width 6mil, minimum drill 0.35mm, track to track 6mil, track to pad 6mil, pad to pad 6mil, via to via 6mil, smd to smd 6mil, copper to edge 40mil, drill to drill 6mil, minimum pad ring 10mil, minimum via ring 8mil, stop-mask expansion 4mil, vias tented up to drill 0mil, thermal gap 10mil
Holes 3 mm at 97,3 3,97 3,3 97,97

### Footprints (pad centres in the part's own frame; a part is rotated, then mirrored left to right if it is on the bottom)
CPOL-RADIAL-5MM-10MM = drill 0.9 pad 1.93 square: + 2.5,0 | drill 0.9 pad 1.93: - -2.5,0
CERAMIC-2.54 = drill 0.635 pad 1.143: 1 -1.27,0; 2 1.27,0
DO41-10 = drill 1.118 pad 1.93: A 5.08,0; C -5.08,0
DO-1N4148 = drill 0.9: A -3.81,0; C 3.81,0
POLOLU-DRV8825 = drill 0.8 pad 1.676: 1 1.27,19.05; 2 1.27,16.51; 3 1.27,13.97; 4 1.27,11.43; 5 1.27,8.89; 6 1.27,6.35; 7 1.27,3.81; 8 1.27,1.27; 10 13.97,3.81; 11 13.97,6.35; 12 13.97,8.89; 13 13.97,11.43; 14 13.97,13.97; 16 13.97,19.05 | drill 0.8 pad 1.676 square: 9 13.97,1.27; 15 13.97,16.51 | drill 0.305: GND@1 5.08,15.24; GND@2 6.35,15.24; GND@3 7.62,15.24; GND@4 8.89,15.24; GND@5 10.16,15.24; GND@6 10.16,13.97; GND@7 8.89,13.97; GND@8 7.62,13.97; GND@9 6.35,13.97; GND@10 5.08,13.97; GND@11 5.08,12.7; GND@12 6.35,12.7; GND@13 7.62,12.7; GND@14 8.89,12.7; GND@15 10.16,12.7; GND@16 10.16,11.43; GND@17 8.89,11.43; GND@18 7.62,11.43; GND@19 6.35,11.43; GND@20 5.08,11.43; GND@21 5.08,10.16; GND@22 6.35,10.16; GND@23 7.62,10.16; GND@24 8.89,10.16; GND@25 10.16,10.16; GND@26 5.08,8.89; GND@27 6.35,8.89; GND@28 7.62,8.89; GND@29 8.89,8.89; GND@30 10.16,8.89; GND@31 10.16,7.62; GND@32 8.89,7.62; GND@33 7.62,7.62; GND@34 6.35,7.62; GND@35 5.08,7.62; GND@36 5.08,6.35; GND@37 6.35,6.35; GND@38 7.62,6.35; GND@39 8.89,6.35; GND@40 10.16,6.35; GND@41 10.16,5.08; GND@42 8.89,5.08; GND@43 7.62,5.08; GND@44 6.35,5.08; GND@45 5.08,5.08 | smd 6.35 x 12.7 bottom: GND@50 7.62,10.16 | smd 6.35 x 12.7: GND@51 7.62,10.16
MULTIWATT-15 = drill 1.2 long: 1 -8.89,-7.62; 2 -7.62,-2.54; 3 -6.35,-7.62; 4 -5.08,-2.54; 5 -3.81,-7.62; 6 -2.54,-2.54; 7 -1.27,-7.62; 8 0,-2.54; 9 1.27,-7.62; 10 2.54,-2.54; 11 3.81,-7.62; 12 5.08,-2.54; 13 6.35,-7.62; 14 7.62,-2.54; 15 8.89,-7.62
1X04_LONGPADS = drill 1.118 pad 1.88 long: 1 0,0; 2 2.54,0; 3 5.08,0; 4 7.62,0
2X10_NOSILK = drill 1.016 pad 1.88: 1 0,0; 2 0,2.54; 3 2.54,0; 4 2.54,2.54; 5 5.08,0; 6 5.08,2.54; 7 7.62,0; 8 7.62,2.54; 9 10.16,0; 10 10.16,2.54; 11 12.7,0; 12 12.7,2.54; 13 15.24,0; 14 15.24,2.54; 15 17.78,0; 16 17.78,2.54; 17 20.32,0; 18 20.32,2.54; 19 22.86,0; 20 22.86,2.54
1X06_LONGPADS = drill 1.118 pad 1.88 long: 1 0,0; 2 2.54,0; 3 5.08,0; 4 7.62,0; 5 10.16,0; 6 12.7,0
2X3 = drill 1.016 pad 1.88: 1 0,0; 2 0,2.54; 3 2.54,0; 4 2.54,2.54; 5 5.08,0; 6 5.08,2.54
1X03_LONGPADS = drill 1.118 pad 1.88 long: 1 0,0; 2 2.54,0; 3 5.08,0
1X08_LONGPADS = drill 1.118 pad 1.88 long: 1 0,0; 2 2.54,0; 3 5.08,0; 4 7.62,0; 5 10.16,0; 6 12.7,0; 7 15.24,0; 8 17.78,0
1X03 = drill 1.016 pad 1.88: 1 0,0; 2 2.54,0; 3 5.08,0
POWER_JACK_PTH_LOCK = drill 2.997 pad 4.115: GND 0.025,6.557; GNDBREAK 3.762,10.7 | drill 3.2 pad 4.115: PWR 0,13.878
5VBUCK = drill 1.016 long: GND 6.28,2.81; VIN 3.74,2.81; VOUT 8.82,2.81
TO220BV = drill 1.016 long: D 0,-2.54; G -2.54,-2.54; S 2.54,-2.54
TO92260P520H533-3 = drill 0.91: D 2.6,0; G 0,0 | drill 0.91 square: S -2.6,0
AXIAL-0.3 = drill 0.9 pad 1.88: P$1 -3.81,0; P$2 3.81,0
TACTILE_SWITCH_PTH_6.0MM = drill 1.016 pad 1.88: 1 -3.251,2.261; 2 3.251,2.261; 3 -3.251,-2.261; 4 3.251,-2.261
F/HMB = drill 1.016 pad 2.54 octagon: + 3.81,0; - -3.81,0
EDG-03 = drill 0.813 long: 1 -2.54,-3.81; 2 0,-3.81; 3 2.54,-3.81; 4 2.54,3.81; 5 0,3.81; 6 -2.54,3.81
ESP32MINI = drill 0.9: 0 29.21,15.875; 2 29.21,13.335; 3V3 3.81,13.335; 4 29.21,18.415; 5 3.81,15.875; 5V 26.67,13.335; 16 26.67,18.415; 17 26.67,20.955; 18 3.81,23.495; 19 3.81,20.955; 21 26.67,23.495; 22 26.67,26.035; 23 3.81,18.415; 25 29.21,26.035; 26 3.81,26.035; 27 29.21,28.575; 32 29.21,23.495; 33 1.27,20.955; 34 1.27,18.415; 35 1.27,23.495; CMD 1.27,8.255; GND@1 1.27,31.115; GND@2 29.21,31.115; GND@3 26.67,15.875; NC 1.27,28.575; NC.1 1.27,13.335; RST 3.81,31.115; RX0 26.67,28.575; SD0 26.67,8.255; SD1 29.21,10.795; SD2 1.27,10.795; SVN 1.27,26.035; SVP 3.81,28.575; TCK 3.81,10.795; TDI 29.21,20.955; TDO 26.67,10.795; TMS 1.27,15.875; TX0 26.67,31.115 | drill 0.9 square: CLK 29.21,8.255; SD3 3.81,8.255

### Placement (x,y rotation side)
C1  46.26,70.66 180 top
C2  40.01,17.78 180 top
C3  45.09,17.78 0 top
C4  79.38,15.24 270 top
C5  12.7,10.48 180 top
C6  53.34,35.56 270 top
C7  74.41,64.1 270 top
C8  61.59,77.47 90 top
C9  64.45,77.47 90 top
C10  53.34,55.24 270 top
C11  74.3,40.64 270 top
D1  52.8,6.17 0 top
D2  90.17,90.81 90 top
D3  85.72,64.77 270 top
D4  88.9,64.77 270 top
D5  13.65,67.31 270 top
D6  82.55,64.77 270 top
D7  79.38,64.77 270 top
D8  84.45,50.8 270 top
D9  88.27,50.8 270 top
D10  80.64,50.8 270 top
D11  76.83,50.8 270 top
D12  69.22,88.9 270 top
D13  90.17,78.11 90 top
D14  69.22,78.42 270 top
D15  55.24,83.82 0 top
D16  55.24,78.74 0 top
D17  84.45,31.11 90 top
D18  88.27,31.11 90 top
D19  80.64,31.11 90 top
D20  76.83,31.11 90 top
D21  86.36,44.45 90 top
D22  90.17,44.45 90 top
D23  82.55,44.45 90 top
D24  78.74,44.45 90 top
DR1  58.42,22.86 270 top
IC1  62.59,59.15 90 top
IC2  62.87,36.2 90 top
J1  36.83,3.17 0 top
J2  64.77,3.17 0 top
J3  96.52,53.98 90 top
J4  36.2,57.15 180 top
J5  36.2,21.59 180 top
J6  96.52,32.38 90 top
J7  26.04,96.52 0 top
J8  13.34,96.52 0 top
J9  3.06,62.27 90 top
J10  8.37,74.89 270 top
J11  2.22,90.81 0 top
J12  2.22,87.31 0 top
J13  2.22,83.82 0 top
J15  43.81,96.52 180 top
J16  21.91,3.17 0 top
J17  7.62,3.17 0 top
J18  50.16,96.52 0 top
J19  96.52,78.11 90 top
J20  60.33,92.08 180 top
JACK  99.87,14.07 90 top
PWR1  35.02,11.89 0 top
Q1  83.82,91.44 90 top
Q2  40.64,81.28 180 top
Q3  83.82,78.74 90 top
Q4  19.05,82.55 180 top
Q5  29.84,82.55 180 top
Q6  20.95,75.56 0 top
Q7  78.11,97.79 180 top
Q8  78.11,84.45 180 top
R1  29.84,85.72 0 top
R2  50.16,24.13 90 top
R3  52.7,24.13 90 top
R4  55.24,24.13 90 top
R5  78.11,87.63 0 top
R6  78.11,90.17 0 top
R7  40.64,84.45 180 top
R8  29.84,88.27 0 top
R9  19.05,85.72 0 top
R10  19.05,88.27 0 top
R11  40.64,89.53 180 top
R12  40.64,87 0 top
R13  71.75,88.9 270 top
R14  18.73,67.31 90 top
R15  16.19,67.31 90 top
R16  12.7,82.55 270 top
R17  12.7,12.7 180 top
R18  55.24,86.36 0 top
R19  55.24,88.9 0 top
R20  78.11,74.93 0 top
R21  78.11,77.47 0 top
R22  78.11,80.01 180 top
R23  78.11,92.71 180 top
R24  71.75,78.42 90 top
R25  23.5,67.31 270 top
R26  20.95,67.31 90 top
R27  64.45,85.09 270 top
R28  61.59,85.09 90 top
R29  55.24,76.2 180 top
R30  55.24,81.28 180 top
S1  5.08,55.24 90 top
S2  5.08,17.78 90 top
SG1  33.02,69.22 90 top
SW2  52.7,12.7 180 top
U$1  5.02,53.34 270 top

### Tracks (layer width: path | path; a pad name or v marks a point on that pad's centre or on a via)
34  (via drill 0.35)
  Top 0.203: U$1.34 23.47,52.09 23.47,54.59 J4.12 | R27.P$2 64.45,80.01 | 64.45,80.01 C9.2 | R18.P$2 59.03,86.32 59.03,83.92 D15.C 59.12,83.74 59.12,81.34 R30.P$1 59.21,81.34 60.54,80.01 64.45,80.01 | v46.32,69.96 v35.92,59.56
  Bottom 0.203: v35.92,59.56 26.76,59.56 24.8,57.61 24.8,56.72 23.56,55.47 23.56,54.67 J4.12 | v46.32,69.96 51.3,74.94 52.72,74.94 R30.P$1
35  (via drill 0.35)
  Top 0.203: R28.P$2 R19.P$2 59.03,88.81 59.03,88.1 57.78,86.86 57.78,80.19 59.12,78.85 D16.C | J4.8 28.54,54.59 28.54,52.09 U$1.35 28.45,52.01 27.29,52.01 25.78,50.49 25.51,50.49 24.98,49.96 24.98,49.16 25.6,48.54 40.09,48.54 v41.87,50.32 | C8.2 61.52,78.77 59.12,78.77 D16.C | D16.C 59.12,78.68 59.12,76.28 R29.P$1
  Bottom 0.203: v41.87,50.32 41.87,59.03 59.03,76.19 R29.P$1
!RST
  Bottom 0.203: 36.18,50.76 36.18,49.61 U$1.RST | 36.18,50.76 37.43,52.01 37.43,55.92 J4.1 | 36.18,50.76 13.16,50.76 12,51.92 7.38,51.92 S1.3
!SEN
  Bottom 0.203: J5.4 33.6,19.11 32.45,20.27 32.45,22.14 33.52,23.2 33.52,24.09 U$1.27 33.6,24.18 34.58,25.16 36.54,25.16 36.8,24.89 73.25,24.89 76.54,21.6 77.43,21.6 DR1.1
+3V3
  Top 0.203: R4.P$2 55.21,27.91 52.72,27.91 R3.P$2 52.63,27.91 50.23,27.91 R2.P$2 50.14,28 40.09,28 18.49,49.61 U$1.3V3 18.4,49.61 18.4,50.76 19.38,51.74 19.38,53.7 18.49,54.59 J4.16 18.4,54.67 18.4,57.07 J4.15 | Q5.G 29.78,82.59 29.16,82.59 26.05,85.7 R1.P$1 26.05,85.79 26.05,88.19 R8.P$1 26.05,88.37 28.54,90.86 28.54,96.46 J7.2 | J13.3 7.29,83.83 J12.3 | J11.3 7.29,90.77 7.29,87.39 J12.3 | J12.3 7.38,86.32 12.62,86.32 R16.P$1 | R18.P$1 51.47,86.41 51.47,88.9 R19.P$1
  Bottom 0.203: R16.P$1 12.71,86.32 14.58,84.45 15.91,84.45 17.78,82.59 19.02,82.59 Q4.G 19.11,82.59 20.09,83.57 22.4,83.57 24.54,85.7 25.96,85.7 R1.P$1 | J18.8 67.92,96.46 66.67,95.21 66.67,95.12 61.7,90.14 52.72,90.14 51.47,88.9 R19.P$1 | R18.P$1 51.38,86.32 49.52,84.45 R7.P$1 41.34,81.34 40.72,81.34 Q2.G 40.54,81.25 39.56,80.28 32.89,80.28 30.67,82.5 29.87,82.5 Q5.G | J4.15 18.49,57.16 18.49,59.3 22.23,63.03 22.23,63.92 16.27,69.88 15.73,69.88 14.67,70.94 14.67,75.03 7.38,82.32 7.38,83.74 J13.3
+5V
  Top 0.381: J5.15 18.49,21.6 19.47,22.58 19.47,24.54 18.4,25.6 18.4,26.67 U$1.5V 18.49,26.85 18.49,28.36 20.36,30.23 20.36,30.76 19.82,31.29 16.36,31.29 11.47,26.4 11.47,10.67 C5.2 11.38,10.4 11.38,4.36 10.22,3.2 J17.2 | 46.32,17.16 46.32,17.78 C3.2 | 46.32,17.16 43.92,14.76 PWR1.VOUT | DR1.10 61.87,8.89 55.92,14.85 48.72,14.85 46.49,17.07 46.32,17.16 | C11.2 74.23,39.29 72.45,39.29 70.67,37.52 70.5,37.52 IC2.9 | C7.2 74.41,62.76 72.72,62.76 70.41,60.45 70.23,60.45 IC1.9 70.05,60.54 68.9,61.7 68.81,61.7 67.3,63.21 67.3,64.81 66.59,65.52 51.92,65.52 45.3,72.14 | J8.2 15.82,96.46 15.82,88.81 15.38,88.37 R10.P$1 15.2,88.19 15.2,85.79 R9.P$1 15.38,85.61 15.38,82.06 16,81.43 19.2,81.43 24.8,75.83 24.8,70.59 24,69.79 17.87,69.79 10.4,62.32 3.11,62.32 J9.1 | R22.P$2 74.23,80.01 74.23,82.68 71.83,85.08 R13.P$2 | J15.1 43.83,96.46 44.45,95.83 R11.P$1 44.54,89.43 44.54,88.72 45.78,87.48 45.78,72.63 45.3,72.14 | 45.3,72.14 43.83,70.67 C1.+
  Bottom 0.381: J9.1 3.02,62.23 3.02,60.54 1.51,59.03 1.51,43.47 18.31,26.67 U$1.5V | C5.2 11.47,10.4 12.36,9.51 20.89,9.51 26.94,3.47 26.94,3.2 J16.3 27.11,3.56 36.36,12.8 41.96,12.8 43.83,14.67 PWR1.VOUT | C11.2 74.32,39.38 74.32,40.63 75.21,41.52 75.21,52.36 72.36,55.21 72.36,58.41 70.41,60.36 70.23,60.36 IC1.9 | SG1.+ 33.07,72.99 35.38,70.67 43.74,70.67 C1.+ 43.92,70.76 50.67,77.52 51.74,77.52 56.81,82.59 59.38,82.59 62.94,86.14 69.7,86.14 70.67,85.17 71.74,85.17 R13.P$2 | J8.2 15.91,96.55 15.91,96.81 17.87,98.77 41.78,98.77 43.74,96.81 43.74,96.55 J15.1
BOOT
  Top 0.203: U$1.0 20.89,23.29 19.74,22.14 19.74,20.27 J5.14
  Bottom 0.203: S2.3 7.38,14.58 16.45,14.58 20.89,19.02 J5.14
BUZZ
  Top 0.203: U$1.TDI 25.96,24.09 25.96,23.2 24.8,22.05 24.8,20.27 25.96,19.11 J5.10
  Bottom 0.203: R26.P$1 20.89,63.48 20.45,63.48 15.38,58.41 12,58.41 6.13,52.54 6.13,42.85 22.4,26.58 22.4,26.31 23.56,25.16 24.98,25.16 25.96,24.18 U$1.TDI
CLK
  Top 0.203: U$1.CLK 13.25,24.09 13.25,23.2 12.09,22.05 12.09,20.36 13.34,19.11 J5.20
CMD
  Top 0.203: J4.20 13.34,52.09 U$1.CMD
GND
  Top 0.203: D5.A R15.P$2 16.18,71.21 18.31,73.34 18.31,75.56 Q6.S | J13.1 J12.1 J11.1 2.13,90.86 7.73,96.46 13.34,96.46 J8.1 13.25,96.55 15.38,98.68 21.43,98.68 23.56,96.55 25.96,96.55 J7.1 25.96,96.63 28,98.68 36.54,98.68 38.67,96.55 J15.3 40.01,97.79 40.01,97.88 40.8,98.68 48.01,98.68 J18.1 50.23,96.55 52.63,96.55 J18.2 52.63,96.46 52.63,84.99 51.47,83.83 D15.A 51.47,83.74 51.47,81.34 R30.P$2 51.47,81.25 51.47,78.77 D16.A 51.47,78.68 51.47,76.28 R29.P$2 | C1.- 48.81,70.67 48.81,73.61 51.38,76.19 R29.P$2 | Q8.S 83.21,84.45 86.32,81.34 Q3.S | Q7.S 80.72,97.79 80.72,93.88 81.88,92.72 R23.P$1 | Q1.S 86.32,93.97 83.21,93.97 81.97,92.72 R23.P$1 | Q8.S 80.72,84.54 80.72,91.48 81.88,92.63 R23.P$1 | R24.P$1 71.74,74.68 70.23,76.19 64.54,76.19 C9.1 64.45,76.19 61.61,76.19 C8.1 61.52,76.19 60.27,74.94 58.59,74.94 57.25,76.28 51.56,76.28 R29.P$2 | U$1.GND@1 36.18,52.09 36.18,54.59 J4.2 | J4.4 33.69,54.59 36.09,54.59 J4.2 | C7.1 74.41,65.43 72.9,65.43 70.23,68.1 IC1.15 70.23,68.19 71.74,69.7 71.74,74.59 R24.P$1 | IC1.8 65.08,59.12 63.74,57.78 53.34,57.78 C10.- 53.25,57.7 50.23,54.67 36.27,54.67 J4.2 | Q8.S 80.72,84.37 80.72,79.65 74.77,73.7 71.83,73.7 R24.P$1 | U$1.GND@3 20.89,25.51 21.87,24.54 21.87,22.49 20.98,21.6 J5.13 | 13.96,4.45 13.96,10.4 C5.1 | 13.96,4.45 12.71,3.2 J17.3 | 13.96,4.45 14.05,4.45 15.29,3.2 21.87,3.2 J16.1 21.96,3.2 24.45,3.2 J16.2 24.45,3.29 26.49,5.33 30.05,5.33 32.18,3.2 36.8,3.2 J1.1 36.89,3.2 39.29,3.2 J1.2 39.29,3.29 41.34,5.33 46.76,5.33 47.21,4.89 48.18,4.89 48.98,5.69 48.98,8.98 | C3.1 C2.1 41.34,17.69 41.34,14.76 PWR1.GND 41.43,14.76 47.21,8.98 48.98,8.98
  Top 0.203: DR1.9 SW2.6 SW2.5 SW2.4 50.14,8.98 48.98,8.98 | 74.32,43.2 74.32,41.96 C11.1 | 74.32,43.2 D11.A 76.9,45.78 78.77,45.78 | IC2.15 70.5,45.07 72.36,45.07 74.23,43.2 74.32,43.2 | IC2.15 70.23,45.34 70.23,50.23 IC1.1 | 78.77,45.78 80.63,45.78 D10.A 80.72,45.78 84.45,45.78 D8.A 84.54,45.78 86.41,45.78 | 78.77,45.78 78.77,49.52 D24.A 78.85,49.52 82.5,49.52 D23.A | 86.41,45.78 88.19,45.78 D9.A | 86.41,45.78 86.41,49.52 D21.A 86.5,49.52 90.14,49.52 D22.A | JACK.GND 93.26,14.13 92.9,14.13 89.26,17.78 JACK.GNDBREAK | DR1.GND@41 63.56,12.71 64.72,12.71 DR1.GND@51 | DR1.GND@40 64.81,12.71 DR1.GND@51 | DR1.GND@51 65.52,13.16 65.96,12.71 DR1.GND@31 66.14,12.71 67.3,12.71 DR1.GND@30 67.39,12.71 68.54,12.71 DR1.GND@25 68.63,12.71 69.79,12.71 DR1.GND@16 69.88,12.71 71.12,12.71 DR1.GND@15 | DR1.GND@51 64.72,13.96 63.56,13.96 DR1.GND@42 63.48,14.05 63.48,15.2 DR1.GND@43 | DR1.GND@39 64.81,13.96 DR1.GND@51 | DR1.GND@32 66.23,13.78 DR1.GND@51 | DR1.GND@29 67.3,14.05 67.12,14.22 DR1.GND@51 | DR1.GND@38 64.81,15.2 65.96,15.2 DR1.GND@51 | DR1.GND@33 66.05,15.2 DR1.GND@51 | DR1.GND@28 67.3,15.2 DR1.GND@51 | DR1.GND@44 63.56,16.54 64.72,16.54 DR1.GND@51 | DR1.GND@37 64.81,16.54 DR1.GND@51 | DR1.GND@34 65.96,16.45 65.79,16.27 DR1.GND@51 | DR1.GND@27 67.3,16.45 67.3,15.73 DR1.GND@51 | DR1.GND@51 67.92,14.67 68.54,14.05 DR1.GND@24 68.63,13.96 69.79,13.96 DR1.GND@17 69.88,14.05 69.88,15.2 DR1.GND@18 69.96,15.2 71.12,15.2 DR1.GND@13 | DR1.GND@45 64.72,17.78 DR1.GND@51 | DR1.GND@36 64.81,17.78 DR1.GND@51 | DR1.GND@35 65.96,17.78 65.52,17.34 DR1.GND@51 | 68.54,15.2 DR1.GND@51 | DR1.GND@51 68.01,15.73 68.54,16.27 68.54,16.45 DR1.GND@22 68.63,16.54 69.79,16.54 DR1.GND@19
  Top 0.203: DR1.GND@15 DR1.GND@14 71.21,13.96 72.36,13.96 DR1.GND@7 72.45,13.96 73.61,13.96 DR1.GND@4 73.7,14.05 73.7,15.2 DR1.GND@3 | DR1.GND@15 71.21,12.71 72.36,12.71 DR1.GND@6 72.45,12.71 73.61,12.71 DR1.GND@5 73.7,12.62 74.85,11.47 74.85,8.89 DR1.15 | DR1.GND@13 DR1.GND@12 71.21,16.54 72.36,16.54 DR1.GND@9 72.45,16.54 73.61,16.54 DR1.GND@2 | DR1.GND@8 72.36,15.2 71.21,15.2 DR1.GND@13 | 68.54,17.78 DR1.GND@26 | 68.54,17.78 DR1.GND@21 DR1.GND@20 DR1.GND@11 | 68.54,17.78 DR1.GND@51 | DR1.GND@11 DR1.GND@10 DR1.GND@1 79.3,17.78 C4.- | DR1.GND@11 70.94,17.87 70.94,22.05 70.5,22.49 70.5,27.29 IC2.1 68.36,29.43 68.36,33.25 65.43,36.18 IC2.8 | C6.- 53.34,38.05 63.48,38.05 65.34,36.18 IC2.8 | IC2.15 70.41,45.07 67.47,42.14 67.47,38.14 65.52,36.18 IC2.8
  Bottom 0.203: S1.1 2.85,52.01 2.85,56.81 5.25,59.21 5.25,62.76 3.29,64.72 3.11,64.72 J9.2 3.02,64.9 3.02,67.3 J9.3 3.11,67.3 6.93,71.12 | 6.93,71.12 D5.A | 6.93,71.12 6.93,78.94 2.22,83.66 J13.1 | IC1.8 65.16,59.21 66.41,60.45 66.5,60.45 68.1,62.05 68.1,65.96 70.14,68.01 IC1.15 | C5.1 13.2,11.25 | 13.2,11.25 13.07,11.38 8.45,11.38 5.33,14.49 2.85,14.49 S2.1 | 13.2,11.25 15.91,13.96 17.6,13.96 22.23,18.58 22.23,19.47 20.98,20.71 20.98,21.51 J5.13 | 37.43,20.27 37.43,22.05 36.18,23.29 36.18,24.09 U$1.GND@2 | 37.43,20.27 36.27,19.11 J5.2 | C2.1 40.01,17.78 37.52,20.27 37.43,20.27 | DR1.9 59.74,8.89 63.48,12.62 DR1.GND@51 68.63,15.29 | JACK.GNDBREAK 89.17,17.78 79.39,17.78 C4.- | C7.1 74.5,65.34 74.5,63.92 75.56,62.85 75.56,52.72 78.68,49.61 D24.A
  pour Top: 0,0 0,100.33 1.91,100.33 100.33,100.33 100.33,96.52 100.33,0 98.42,0
  pour Bottom: 0,0 0,100.33 1.27,100.33 100.33,100.33 100.33,99.69 100.33,0 99.69,0
H1A  (via drill 0.35)
  Top 0.203: U$1.18 28.54,49.61 29.69,49.61 30.76,50.67 31.56,50.67 32.63,51.74 32.63,52.54 33.25,53.16 v34.31,53.16 34.31,53.07 34.58,52.81 34.58,52.18 35.74,51.03 47.12,51.03 51.38,55.3 70.14,55.3 IC1.5
  Bottom 0.203: v34.31,53.16 33.34,53.16 32.36,54.14 32.36,55.12 31.56,55.92 29.78,55.92 28.63,57.07 J4.7
H1B  (via drill 0.35)
  Top 0.203: U$1.16 23.47,26.67 23.47,25.51 24.45,24.54 24.45,22.49 23.56,21.6 J5.11 | v37.34,40.54 37.69,40.18 44.18,40.18 45.61,41.6 57.78,41.6 67.21,51.03 67.21,52.36 68.81,53.96 71.39,53.96 72.28,54.85 72.28,55.83 70.23,57.87 IC1.7
  Bottom 0.203: v37.34,40.54 23.47,26.67 U$1.16
H2A  (via drill 0.35)
  Top 0.203: v54.41,44.45 47.47,44.45 v43.92,40.89
  Bottom 0.203: 24.71,22.14 23.47,23.38 23.47,24.09 U$1.4 | 24.71,22.14 24.71,20.27 J5.12 | v54.41,44.45 54.41,51.03 63.74,60.36 63.83,60.36 65.08,61.61 IC1.10 | v43.92,40.89 29.52,26.49 29.52,26.31 28.36,25.16 28.18,25.16 26.94,23.91 26.94,23.74 26.05,22.85 25.51,22.85 24.8,22.14 24.71,22.14
H2B  (via drill 0.35)
  Top 0.203: J5.17 15.91,21.6 16.8,22.49 16.8,24.54 15.82,25.51 15.82,26.67 U$1.TDO 15.82,26.76 v19.56,30.49 | v39.74,55.38 47.56,55.38 56.36,64.19 65.08,64.19 IC1.12
  Bottom 0.203: v39.74,55.38 39.74,50.67 v19.56,30.49
H3A  (via drill 0.35)
  Top 0.203: U$1.33 26.05,52.09 26.05,54.59 J4.10 | v30.14,58.59 v38.49,58.59
  Bottom 0.203: v38.49,58.59 41.16,55.92 41.16,47.56 56.27,32.45 70.41,32.45 IC2.5 | v30.14,58.59 28.27,58.59 27.29,57.61 27.29,55.92 26.05,54.67 J4.10
H3B  (via drill 0.35)
  Top 0.203: J4.11 23.56,57.07 24.71,55.92 24.71,51.92 23.47,50.67 23.47,49.61 U$1.23 23.56,49.61 24.98,48.18 51.65,48.18 v55.74,44.09
  Bottom 0.203: v55.74,44.09 62.32,37.52 66.67,37.52 69.25,34.94 70.41,34.94 IC2.7
H4A
  Top 0.203: J4.13 20.89,57.07 19.74,55.92 19.74,51.83 20.89,50.67 U$1.5 20.98,49.52 31.03,39.47 53.7,39.47 54.41,38.76 65.34,38.76 IC2.10
H4B
  Top 0.203: J4.14 20.89,54.59 U$1.TMS 20.89,52.01 21.87,51.03 21.87,49.7 23.02,48.54 23.65,48.54 32.36,39.83 47.21,39.83 48.63,41.25 65.34,41.25 IC2.12
HB1A  (via drill 0.35)
  Top 1.016: D8.C 84.45,58.41 85.7,59.65 D3.A | v74.32,48.63 75.48,48.63 79.83,52.98 95.48,52.98 96.46,53.96 J3.1
  Bottom 1.016: v74.32,48.63 68.72,48.63 65.88,51.47 65.16,51.47 IC1.2 | D8.C 84.45,55.83 85.97,55.83 87.74,54.05 96.46,54.05 J3.1
HB1B
  Top 1.016: IC1.3 70.23,52.81 77.97,52.81 79.39,54.23 86.59,54.23 88.19,55.83 D9.C 88.72,56.1 89.08,56.45 | 89.08,56.45 96.46,56.45 J3.2 | D4.A 88.9,56.9 89.08,56.45
HB2A
  Top 1.016: D6.A 78.14,64.1 73.08,64.1 71.74,65.43 70.23,65.43 IC1.13
  Bottom 1.016: D6.A 83.52,58.72 | 83.52,58.72 84.19,58.05 89.61,58.05 90.59,59.03 96.46,59.03 J3.3 | 83.52,58.72 80.72,55.92 D10.C
HB2B
  Bottom 1.016: 79.3,61.61 79.3,59.74 D7.A 79.03,59.3 76.9,57.16 76.9,55.92 D11.C | 79.3,61.61 79.3,62.23 71.92,69.61 68.63,69.61 65.88,66.85 65.16,66.85 IC1.14 | 79.3,61.61 96.46,61.61 J3.4
HB3A  (via drill 0.35)
  Top 1.016: J6.4 91.92,40.01 90.86,41.07 88.1,41.07 86.41,39.38 D21.C 86.32,38.85 86.32,38.14 84.45,36.27 D17.A | v69.7,24.09 65.43,28.36 65.43,28.54 IC2.2 | v79.83,31.56 v72.36,24.09
  Bottom 1.016: v72.36,24.09 v69.7,24.09 | v79.83,31.56 84.45,36.18 D17.A
HB3B
  Top 1.016: 90.77,38.76 90.23,39.29 D22.C | 90.77,38.76 92.01,37.52 96.46,37.52 J6.3 | 90.77,38.76 88.28,36.27 D18.A
  Bottom 1.016: IC2.3 70.5,29.87 81.88,29.87 88.19,36.18 D18.A
HB4A
  Top 1.016: IC2.13 70.5,42.49 71.92,42.49 73.79,40.63 75.12,40.63 79.48,36.27 80.63,36.27 D19.A
  Bottom 1.016: J6.2 96.46,34.94 91.83,34.94 88.9,37.87 87.21,37.87 87.03,37.69 85.34,37.69 83.74,39.29 82.59,39.29 D23.C 82.32,38.85 80.72,37.25 80.72,36.27 D19.A
HB4B
  Top 1.016: J6.1 96.46,32.36 86.06,32.36 85.34,31.65 81.43,31.65 76.9,36.18 D20.A
  Bottom 1.016: IC2.14 65.43,43.83 66.05,43.83 68.9,46.67 72.01,46.67 72.99,45.7 72.99,38.85 75.56,36.27 76.81,36.27 D20.A 77.08,36.72 78.68,38.32 78.68,39.29 D24.C
HEN
  Top 0.203: J4.17 15.82,57.07 14.67,55.92 14.67,51.83 15.73,50.76 15.73,49.61 U$1.TCK 15.82,49.52 16.98,49.52 39.83,26.67 58.41,26.67 65.34,33.6 IC2.6
  Bottom 0.203: IC1.11 70.14,62.94 68.1,60.9 68.1,59.56 65.16,56.63 IC1.6 65.08,56.54 63.83,55.3 63.74,55.3 63.03,54.59 63.03,43.65 64.19,42.49 67.92,42.49 70.41,40.01 IC2.11 70.5,40.01 72.54,37.96 72.54,34.4 71.83,33.69 65.43,33.69 IC2.6
LDO
  Top 0.203: J15.2 41.34,96.46 41.34,90.14 44.45,87.03 R12.P$2
LED
  Top 0.203: 41.96,81.34 43.2,81.34 Q2.S | 41.96,81.34 38.85,84.45 R7.P$2 | 29.07,58.41 29.78,57.7 29.78,56.72 30.58,55.92 31.56,55.92 32.36,55.12 32.36,54.14 32.27,54.05 32.27,51.92 31.38,51.03 28.63,51.03 27.2,49.61 26.05,49.61 U$1.19 | 29.07,58.41 27.29,58.41 J4.9 | 41.96,81.34 41.96,71.39 29.07,58.5 29.07,58.41
N$1
  Top 0.203: SW2.2 52.72,16.54 52.72,20.27 R3.P$1
  Bottom 0.203: DR1.3 72.36,21.51 71.39,21.51 68.99,19.11 53.87,19.11 52.72,20.27 R3.P$1
N$2
  Top 0.381: C2.2 38.76,17.78 38.76,14.76 PWR1.VIN 38.94,14.67 47.38,6.22 47.65,6.22 D1.C
N$3
  Top 0.203: SW2.1 55.3,16.54 55.3,20.27 R4.P$1 55.38,20.27 67.56,20.27 68.81,21.51 69.79,21.51 DR1.4
N$4
  Top 0.203: Q7.D 75.56,97.79 75.56,91.48 74.32,90.23 R6.P$1 74.32,90.14 74.32,87.66 R5.P$1
N$5
  Top 0.203: DR1.6 64.81,21.6 67.3,21.6 DR1.5
N$6
  Top 0.203: J10.2 10.94,74.85 10.94,72.45 J10.4 10.94,72.28 10.94,69.88 J10.6 11.02,69.88 16.71,69.88 17.96,71.12 R14.P$2
N$7
  Top 0.203: Q1.G 83.21,88.9 81.97,90.14 R6.P$2
N$8
  Top 0.203: SW2.3 50.14,16.54 50.14,20.27 R2.P$1
  Bottom 0.203: DR1.2 74.85,21.6 73.97,21.6 72.81,22.76 52.63,22.76 50.23,20.36 R2.P$1
N$9
  Top 0.203: Q8.D 75.56,84.45 75.56,78.77 74.32,77.52 R21.P$1 74.32,77.43 74.32,74.94 R20.P$1
N$10
  Top 0.203: R25.P$2 23.56,63.56 31.2,63.56 32.98,65.34 SG1.-
N$11
  Top 0.203: Q3.G 86.32,76.28 83.12,76.28 81.97,77.43 R21.P$2
N$12
  Top 1.016: DR1.11 64.81,8.89 64.81,3.2 J2.1
N$13
  Top 1.016: DR1.12 67.3,8.89 67.3,3.2 J2.2
N$14
  Top 1.016: DR1.13 69.88,8.89 69.88,3.2 J2.3
N$15
  Top 1.016: DR1.14 72.36,8.89 72.36,3.2 J2.4
N$16
  Top 0.203: R24.P$2 D14.A
  Bottom 0.203: 78.14,83.74 78.14,84.45 Q8.G | 78.14,83.74 81.88,80.01 R22.P$1 | R24.P$2 76.54,82.23 78.05,83.74 78.14,83.74
N$17
  Top 0.203: J10.5 8.36,69.88 3.11,69.88 J9.4
N$18
  Top 0.203: Q6.D 23.56,71.12 R25.P$1
N$19
  Top 0.203: Q6.G 20.98,75.56 20.98,71.12 R26.P$2
N$20
  Top 0.203: J10.3 8.36,72.36 3.11,72.36 J9.5
N$21
  Top 0.203: J10.1 8.36,74.94 3.11,74.94 J9.6
N$22
  Top 0.203: D12.A 69.25,92.72 71.74,92.72 R13.P$1 71.83,92.72 74.23,92.72 R23.P$2
  Bottom 0.203: Q7.G 78.05,97.79 78.05,96.46 74.32,92.72 R23.P$2
N$23
  Top 0.203: R11.P$2 36.8,89.52 36.8,87.03 R12.P$1
  Bottom 0.203: Q2.D 38.05,81.34 38.05,85.79 36.89,86.94 R12.P$1
N$24
  Top 0.203: J17.1 7.64,3.2 7.64,11.38 8.89,12.62 R17.P$2
N$25
  Top 0.203: J20.1 60.36,92.1 60.36,96.46 J18.5
N$26
  Top 0.203: J18.4 J20.2
N$27
  Top 0.203: J20.3 55.21,92.1 55.21,96.46 J18.3
N$29
  Top 0.203: R28.P$1 61.61,81.34 61.61,87.21 62.85,88.46 62.85,96.46 J18.6
N$30
  Top 0.203: R27.P$1 64.45,95.57 J18.7
P1  (via drill 0.35)
  Top 0.203: J5.9 26.94,22.49 26.94,24.54 26.05,25.43 26.05,26.67 U$1.17 | v39.83,40.89 v44.36,45.43
  Bottom 0.203: v44.36,45.43 44.36,54.14 65.34,75.12 65.34,79.74 69.16,83.57 69.16,85.08 D12.C | v39.83,40.89 39.83,40.45 26.05,26.67 U$1.17
P2  (via drill 0.35)
  Top 0.203: J4.5 31.11,57.07 32.27,55.92 36.63,55.92 37.16,55.38 v38.58,55.38 38.67,55.38 40.45,57.16 v48.36,57.16
  Bottom 0.203: v38.58,55.38 38.58,50.05 36.72,48.18 33.52,48.18 32.18,49.52 31.11,49.52 U$1.26 | v48.36,57.16 65.79,74.59 69.16,74.59 D14.C
PHIN
  Top 0.203: U$1.SVN 31.11,52.09 J4.6 31.03,54.59 30.32,54.59 28.98,55.92 25.51,55.92 24.71,56.72 24.71,57.7 18.94,63.48 18.76,63.48 R14.P$1 18.67,63.48 16.27,63.48 R15.P$1 16.18,63.56 13.69,63.56 D5.C
PP1
  Top 1.016: 88.72,93.52 90.14,94.94 90.14,95.83 D2.A | 88.72,93.52 86.68,91.48 86.41,91.48 Q1.D | 88.72,93.52 J19.4
PP2
  Top 0.203: Q3.D 86.41,78.77 86.41,79.12 90.14,82.86 90.14,83.12 D13.A 90.23,82.86 92.37,80.72 96.46,80.72 J19.2
RX
  Top 0.203: U$1.RX0 33.6,26.67 33.6,25.51 34.58,24.54 34.58,22.49 33.69,21.6 J5.3
SCL
  Top 0.203: U$1.22 31.11,26.67 31.11,25.43 32.09,24.45 32.09,22.58 31.11,21.6 J5.5 | J7.4 33.69,96.46 33.69,88.28 R8.P$2
  Bottom 0.203: 25.87,82.59 21.69,82.59 Q4.S | 25.87,82.59 31.47,88.19 33.6,88.19 R8.P$2 | 25.87,82.59 25.87,77.97 36.98,66.85 36.98,59.12 40.45,55.65 40.45,47.74 44.63,43.56 44.63,40.63 31.11,27.11 31.11,26.67 U$1.22
SCL5
  Top 0.203: Q4.D 16.54,82.59 17.25,82.59 22.85,88.19 R10.P$2 22.85,88.37 20.98,90.23 20.98,96.46 J8.4
SD0
  Top 0.203: U$1.SD0 13.34,26.67 13.34,25.87 14.31,24.89 14.31,22.58 13.34,21.6 J5.19
SD1
  Top 0.203: U$1.SD1 15.73,24.09 15.73,23.2 14.67,22.14 14.67,20.27 15.82,19.11 J5.18
SD2
  Top 0.203: U$1.SD2 15.82,52.09 15.82,54.59 J4.18
SD3
  Top 0.203: U$1.SD3 13.25,49.61 13.25,50.67 12.09,51.83 12.09,55.83 13.34,57.07 J4.19
SDA
  Top 0.203: J5.7 28.63,21.6 29.52,22.49 29.52,24.54 28.54,25.51 28.54,26.67 U$1.21 28.54,26.76 28.54,32.45 11.73,49.25 11.73,62.94 18.14,69.34 24.27,69.34 32.36,77.43 32.36,82.5 Q5.S 32.45,82.59 32.45,84.54 33.6,85.7 R1.P$2 33.6,85.79 31.11,88.28 J7.3
SDA5
  Top 0.203: Q5.D 27.2,82.59 26.05,82.59 22.94,85.7 R9.P$2
  Bottom 0.203: J8.3 18.49,96.46 18.49,90.14 22.85,85.79 R9.P$2
SDIR
  Top 0.203: U$1.32 28.45,24.09 28.45,23.2 27.38,22.14 27.38,20.27 28.54,19.11 J5.8 28.63,19.02 29.87,17.78 37.52,17.78 41.25,21.51 59.65,21.51 DR1.8
SERVO1
  Top 0.203: R17.P$1 16.54,12.71 16.54,17.16 18.4,19.02 J5.16
  Bottom 0.203: U$1.2 18.4,24.09 18.4,23.29 19.65,22.05 19.65,20.27 18.49,19.11 J5.16
STEP
  Top 0.203: U$1.25 31.03,24.09 31.03,23.2 29.87,22.05 29.87,20.36 31.11,19.11 J5.6 31.2,19.11 32.36,20.27 36.63,20.27 39.12,22.76 60.1,22.76 61.25,21.6 62.23,21.6 DR1.7
TEMP
  Top 0.203: J11.2 4.8,90.77 4.8,87.39 J12.2 4.8,87.3 4.8,83.83 J13.2 4.71,83.74 9.69,78.77 12.62,78.77 R16.P$2
  Bottom 0.203: 36.63,58.41 37.78,57.25 37.78,49.78 36.54,48.54 35.74,48.54 34.76,49.52 33.6,49.52 U$1.SVP | 36.63,58.41 34.94,58.41 33.69,57.16 J4.3 | 36.63,58.41 36.63,59.83 32.63,63.83 32.36,63.83 24.71,71.48 24.71,71.65 21.78,74.59 20.54,74.59 19.38,75.74 19.38,76.36 17.07,78.68 12.71,78.68 R16.P$2
TX
  Top 0.203: U$1.TX0 36.18,26.67 36.18,25.51 37.16,24.54 37.16,22.49 36.27,21.6 J5.1
VCC  (via drill 0.35)
  Top 1.016: 81.97,70.41 81.97,74.85 R20.P$2 | 81.97,70.41 82.5,69.88 D6.C 83.03,69.88 85.7,69.88 D3.C 86.14,69.88 88.9,69.88 D4.C 89.17,70.32 90.14,71.3 90.14,72.99 D13.C | D7.C 79.39,69.88 81.25,69.88 81.52,70.14 81.97,70.41 | R5.P$2 81.97,87.57 84.9,87.57 86.68,85.79 90.14,85.79 D2.C | D20.C 76.9,26.05 80.63,26.05 D19.C 81.08,26.05 84.45,26.05 D17.C 84.9,26.05 85.88,26.05 | 85.88,26.05 88.19,26.05 D18.C | DR1.16 77.52,8.89 77.52,10.94 79.3,12.71 C4.+ 79.92,12.71 84.63,12.71 85.97,14.05 JACK.PWR 85.88,14.58 85.88,26.05 | IC1.4 65.08,54.05 54.59,54.05 53.34,52.81 C10.+ | v51.65,38.67 51.65,34.76 C6.+
  Bottom 1.016: 94.32,81.7 95.75,83.12 96.46,83.12 J19.3 | 94.32,81.7 93.97,81.34 93.97,79.92 95.75,78.14 96.46,78.14 J19.1 95.21,78.05 90.23,73.08 D13.C | 94.32,81.7 90.23,85.79 D2.C | J16.4 29.6,3.2 33.6,3.2 36.18,5.78 40.01,5.78 41.87,3.91 41.87,3.2 J1.3 42.41,3.2 44.45,3.2 J1.4 44.9,3.47 47.38,3.47 50.05,6.13 57.87,6.13 D1.A 58.41,6.22 74.94,6.22 77.43,8.71 77.43,8.89 DR1.16 | C6.+ 53.34,32.98 55.21,31.11 IC2.4 65.88,30.94 66.23,30.94 67.92,29.25 67.92,26.76 68.99,25.69 72.01,25.69 72.28,25.96 76.81,25.96 D20.C | v51.65,38.67 53.34,40.36 C10.+ 53.52,53.25 55.03,54.76 55.03,59.83 66.05,70.85 72.36,70.85 73.34,69.88 79.3,69.88 D7.C

### Text on the board
tPlace: GND | 5V | SDA | SCL | GND | 3V3 | SDA | SCL | GND | LED | 5V | GND | GND | IO1 | IO2 | IO3 | IN1 | IN2 | 3V3 | 1-WIRE | I2C - 5V | I2C - 3V3 | LED | IO | FET / DRIVE | TEMP SENSORS | PP1 | VCC | GND | SIG | 3V3 | PP2 | pH SENSOR | VCC | To | Do | Po | GND | GND | H- / BRIDGE | 5V | 2B | 2A | 1A | RESET | 1A | H- / BRIDGE | 3A | 3B | 4A | 4B | DIR | BOOT | M0 | M1 | M2 | 5V BUCK | 1 0 | POWER JACK | CTL | 5V | GND | GND | GND | 5V | VCC | GND | GND | VCC | VCC | A1 | A2 | B1 | B2 | SERVO | POWER | STEPPER | WoodUino / BioReactor_v1